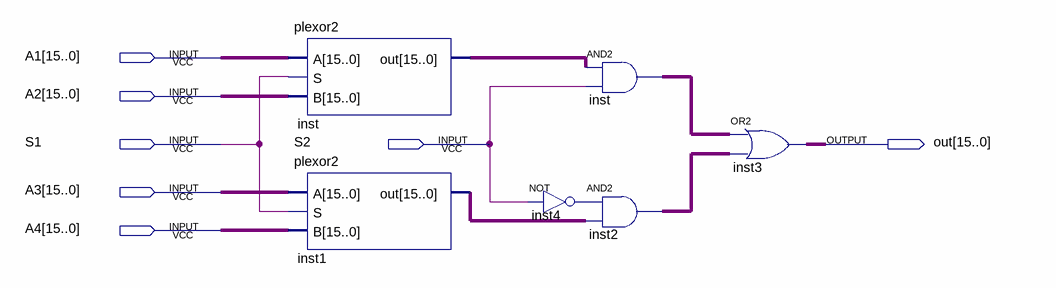
[diagram p0: schematic sheet]
// Quartus schematic plexor4.bdf as structural Verilog: 6 symbols, 7 pins
module plexor4 (
  input  [15:0] A1,
  input  [15:0] A2,
  input  S1,
  input  S2,
  input  [15:0] A3,
  input  [15:0] A4,
  output [15:0] out
);

  wire inst4_out;
  wire [15:0] inst1_out, inst2_out, inst_out, inst_out_2;

  plexor2 inst (.A(A1), .S(S1), .B(A2), .out(inst_out));
  plexor2 inst1 (.A(A3), .S(S1), .B(A4), .out(inst1_out));
  assign inst_out_2 = inst_out & {16{S2}};  // AND2 inst, 16 bits wide
  assign inst2_out = {16{inst4_out}} & inst1_out;  // AND2 inst2, 16 bits wide
  not inst4 (inst4_out, S2);
  assign out = inst_out_2 | inst2_out;  // OR2 inst3, 16 bits wide
endmodule
